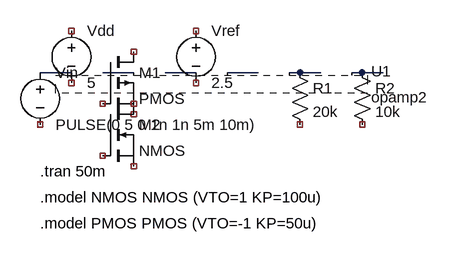
[diagram p0: schematic ttl_to_rs232_converter.asc]
ttl_to_rs232_converter.asc, the LTspice schematic file:
Version 4
SHEET 1 880 680
WIRE 64 48 16 48
WIRE 160 48 112 48
WIRE 256 48 208 48
WIRE 352 48 304 48
WIRE 448 48 400 48
WIRE 544 48 496 48

SYMBOL voltage 16 32 R0
SYMATTR InstName Vin
SYMATTR Value PULSE(0 5 0 1n 1n 5m 10m)

SYMBOL pmos 112 16 R0
SYMATTR InstName M1
SYMATTR Value PMOS

SYMBOL nmos 112 96 R0
SYMATTR InstName M2
SYMATTR Value NMOS

SYMBOL voltage 64 -32 R0
SYMATTR InstName Vdd
SYMATTR Value 5

SYMBOL opamp2 304 32 R0
SYMATTR InstName U1

SYMBOL voltage 256 -32 R0
SYMATTR InstName Vref
SYMATTR Value 2.5

SYMBOL res 400 32 R0
SYMATTR InstName R1
SYMATTR Value 20k

SYMBOL res 496 32 R0
SYMATTR InstName R2
SYMATTR Value 10k

TEXT 16 200 Left 2 !.tran 50m
TEXT 16 240 Left 2 !.model NMOS NMOS (VTO=1 KP=100u)
TEXT 16 280 Left 2 !.model PMOS PMOS (VTO=-1 KP=50u)

The netlist it stands for:
* ttl_to_rs232_converter.asc
Vin N001 NC_01 PULSE(0 5 0 1n 1n 5m 10m)
* M1: PMOS (symbol pmos not certain, pin order unknown); nets seen at it: 
M2 NC_05 NC_06 NC_07 NC_07 NMOS
Vdd NC_08 NC_09 5
* U1: opamp2 (symbol opamp2 not available, pin order unknown); nets seen at it: N001, N002, N003, N004, N005, N006
Vref NC_10 NC_11 2.5
R1 N005 NC_12 20k
R2 N006 NC_13 10k
.model NMOS NMOS
.model PMOS PMOS
.lib standard.mos
.tran 50m
.model NMOS NMOS (VTO=1 KP=100u)
.model PMOS PMOS (VTO=-1 KP=50u)
.backanno
.end